# EAGLE design MTR_1_0 (EAGLE 8.3.2)
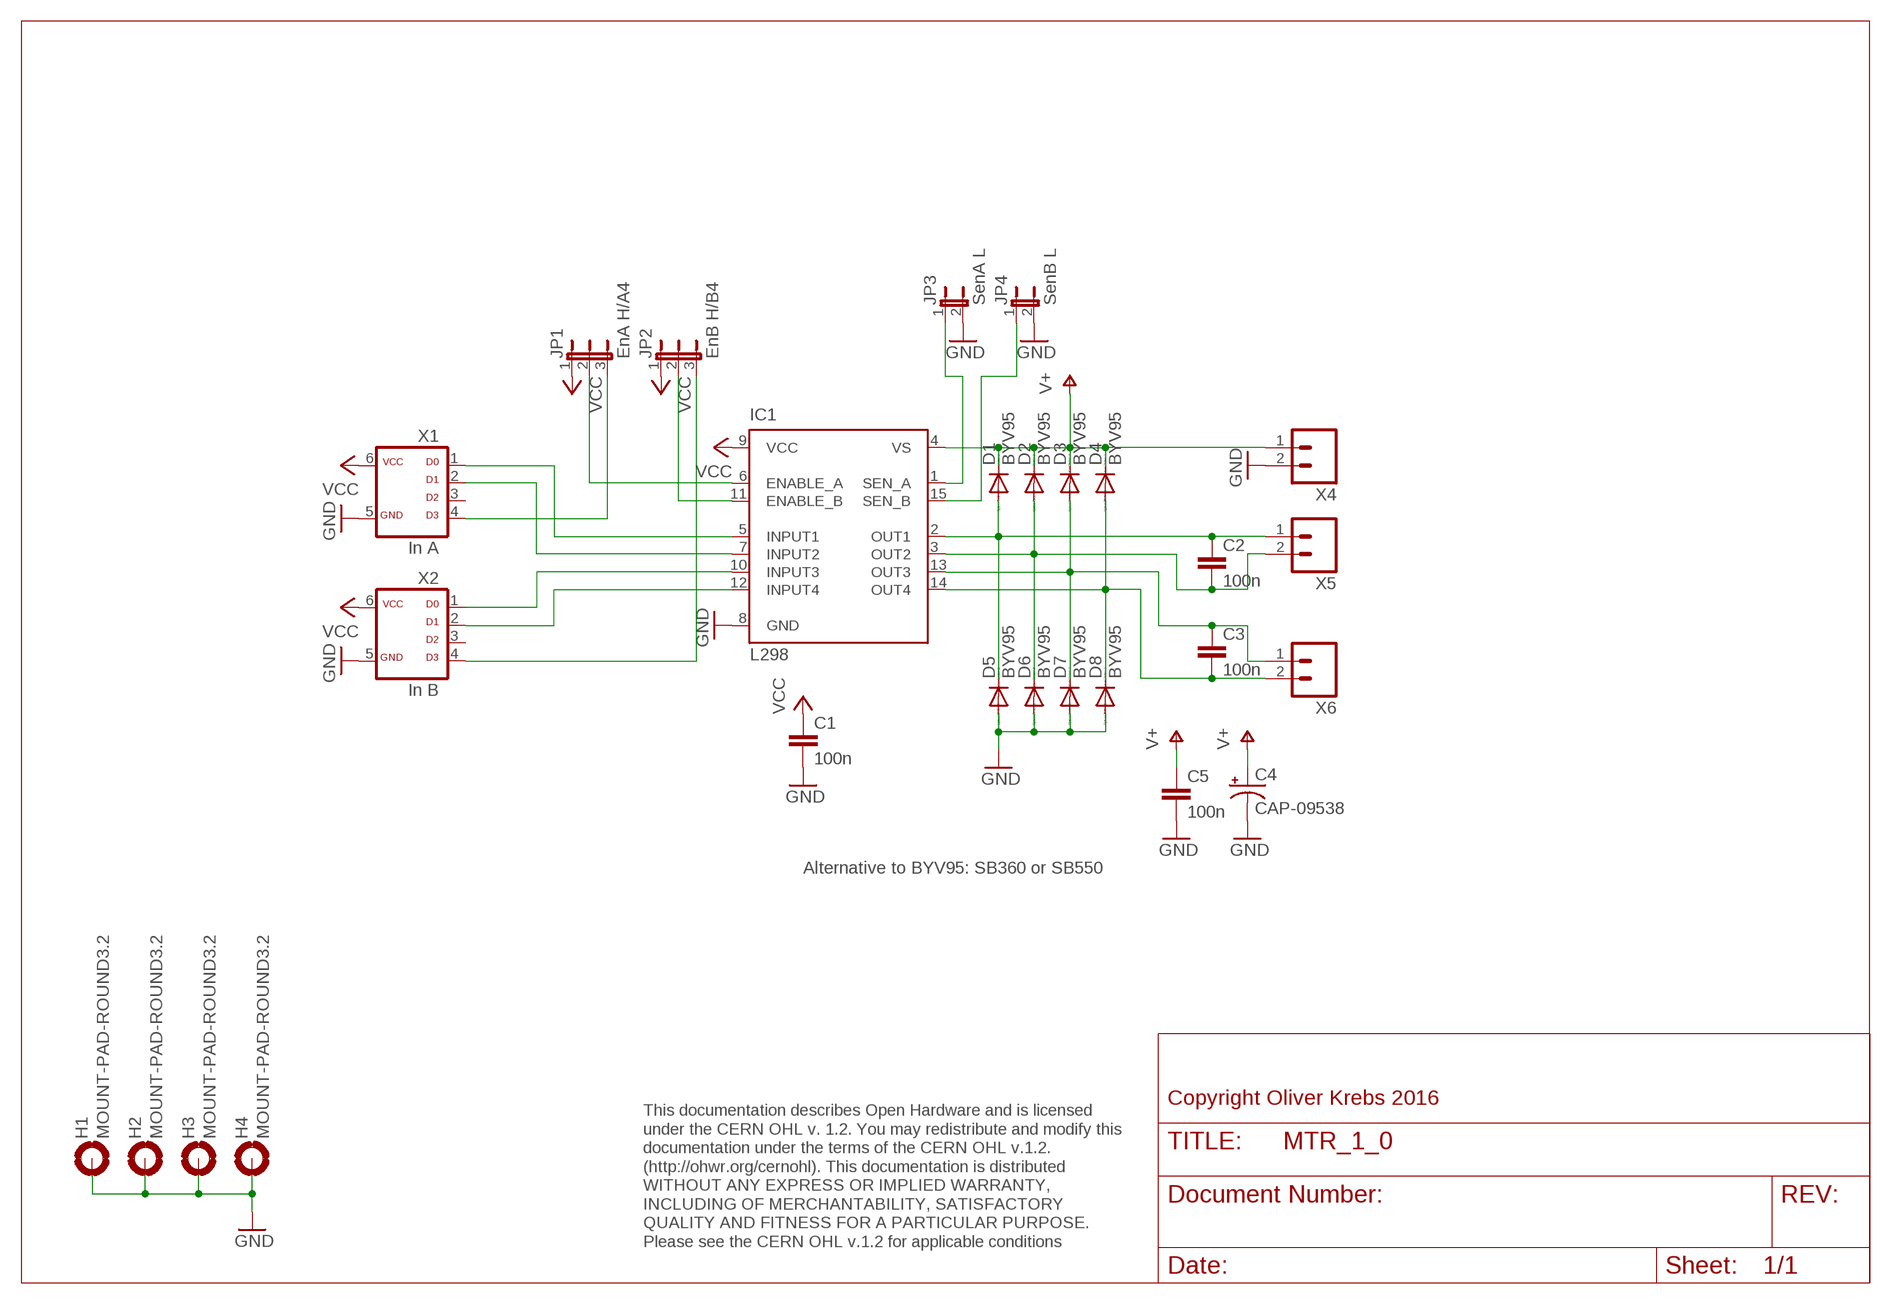
[diagram p0: schematic, sheet 1]

## Parts
C1  100n  C-EU050-025X075  [C050-025X075]
C2  100n  C-EU050-025X075  [C050-025X075]
C3  100n  C-EU050-025X075  [C050-025X075]
C4  CAP-09538  1000UF-25V(PTH)  [CPOL-RADIAL-1000UF-25V]
C5  100n  C-EU050-025X075  [C050-025X075]
D1  BYV95  [SOD57-10]
D2  BYV95  [SOD57-10]
D3  BYV95  [SOD57-10]
D4  BYV95  [SOD57-10]
D5  BYV95  [SOD57-10]
D6  BYV95  [SOD57-10]
D7  BYV95  [SOD57-10]
D8  BYV95  [SOD57-10]
H1  MOUNT-PAD-ROUND3.2  [3,2-PAD]
H2  MOUNT-PAD-ROUND3.2  [3,2-PAD]
H3  MOUNT-PAD-ROUND3.2  [3,2-PAD]
H4  MOUNT-PAD-ROUND3.2  [3,2-PAD]
IC1  L298  [MULTIWATT-15]
JP1  EnA H/A4  JP2EJP2-U  [JP2-U]
JP2  EnB H/B4  JP2EJP2-U  [JP2-U]
JP3  SenA L  JP1E  [JP1]
JP4  SenB L  JP1E  [JP1]
X1  In A  ML6D  [ML-6]
X2  In B  ML6D  [ML-6]
X4  M021.3MM-5.08  [1X02_BIG_5.08]
X5  M021.3MM-5.08  [1X02_BIG_5.08]
X6  M021.3MM-5.08  [1X02_BIG_5.08]

## Nets
GND: C1.2 C4.- C5.2 D5.A D6.A D7.A D8.A H1.B3,2(MOUNT) H2.B3,2(MOUNT) H3.B3,2(MOUNT) H4.B3,2(MOUNT) IC1.8(GND) JP3.2 JP4.2 X1.5 X2.5 X4.2
N$1: JP2.3 X2.4
N$2: IC1.6(ENABLE_A) JP1.2
N$3: IC1.11(ENABLE_B) JP2.2
N$4: JP1.3 X1.4
N$5: C2.1 D1.A D5.C IC1.2(OUT1) X5.1
N$6: C2.2 D2.A D6.C IC1.3(OUT2) X5.2
N$7: C3.1 D3.A D7.C IC1.13(OUT3) X6.1
N$8: C3.2 D4.A D8.C IC1.14(OUT4) X6.2
N$10: IC1.5(INPUT1) X1.1
N$11: IC1.1(SEN_A) JP3.1
N$12: IC1.15(SEN_B) JP4.1
N$13: IC1.7(INPUT2) X1.2
N$14: IC1.10(INPUT3) X2.1
N$15: IC1.12(INPUT4) X2.2
V+: C4.+ C5.1 D1.C D2.C D3.C D4.C IC1.4(VS) X4.1
VCC: C1.1 IC1.9(VCC) JP1.1 JP2.1 X1.6 X2.6
Unconnected: X1.3 X2.3

## Notes on the sheet
- Alternative to BYV95: SB360 or SB550
- Copyright Oliver Krebs 2016
- This documentation describes Open Hardware and is licensed 
  under the CERN OHL v. 1.2. You may redistribute and modify this 
  documentation under the terms of the CERN OHL v.1.2. 
  (http://ohwr.org/cernohl). This documentation is distributed
  WITHOUT ANY EXPRESS OR IMPLIED WARRANTY, 
  INCLUDING OF MERCHANTABILITY, SATISFACTORY 
  QUALITY AND FITNESS FOR A PARTICULAR PURPOSE. 
  Please see the CERN OHL v.1.2 for applicable conditions

## Library data of the parts
C1-C3 C5 = 01-my_rcl:C-EU: CAPACITOR, European symbol
C4 = SparkFun-Capacitors:1000UF-25V(PTH): CAP-08070; PROD_ID: CAP-09538
D1-D8 = diode:BYV95: DIODE fast soft-recovery controlled avalanche rectifier
H1-H4 = holes:MOUNT-PAD-ROUND: MOUNTING PAD, round
IC1 = st-microelectronics:L298: DUAL FULL-BRIDGE DRIVER; MPN: L298N; OC_FARNELL: 1589425; OC_NEWARK: 32M1527
JP1 JP2 = 01-my-jumper:JP2E: JUMPER
JP3 JP4 = 01-my-jumper:JP1E: JUMPER
X1 X2 = 01-my-con:ML6D
X4-X6 = SparkFun-Connectors:M02: Standard 2-pin 0.1" header. Use with - straight break away headers ( PRT-00116) - right angle break away headers (PRT-00553) - swiss pins (PRT-00743) - machine pins (PRT-00117) - female headers (PRT-00115) Molex polarized connector foot print use with: PRT-08233 with associated crimp pins and housings. 2.54_SCREWTERM for use with PRT-10571. 3.5mm Screw Terminal footprints for PRT-08084 5mm Screw Terminal footprints for use with PRT-08432

## Board
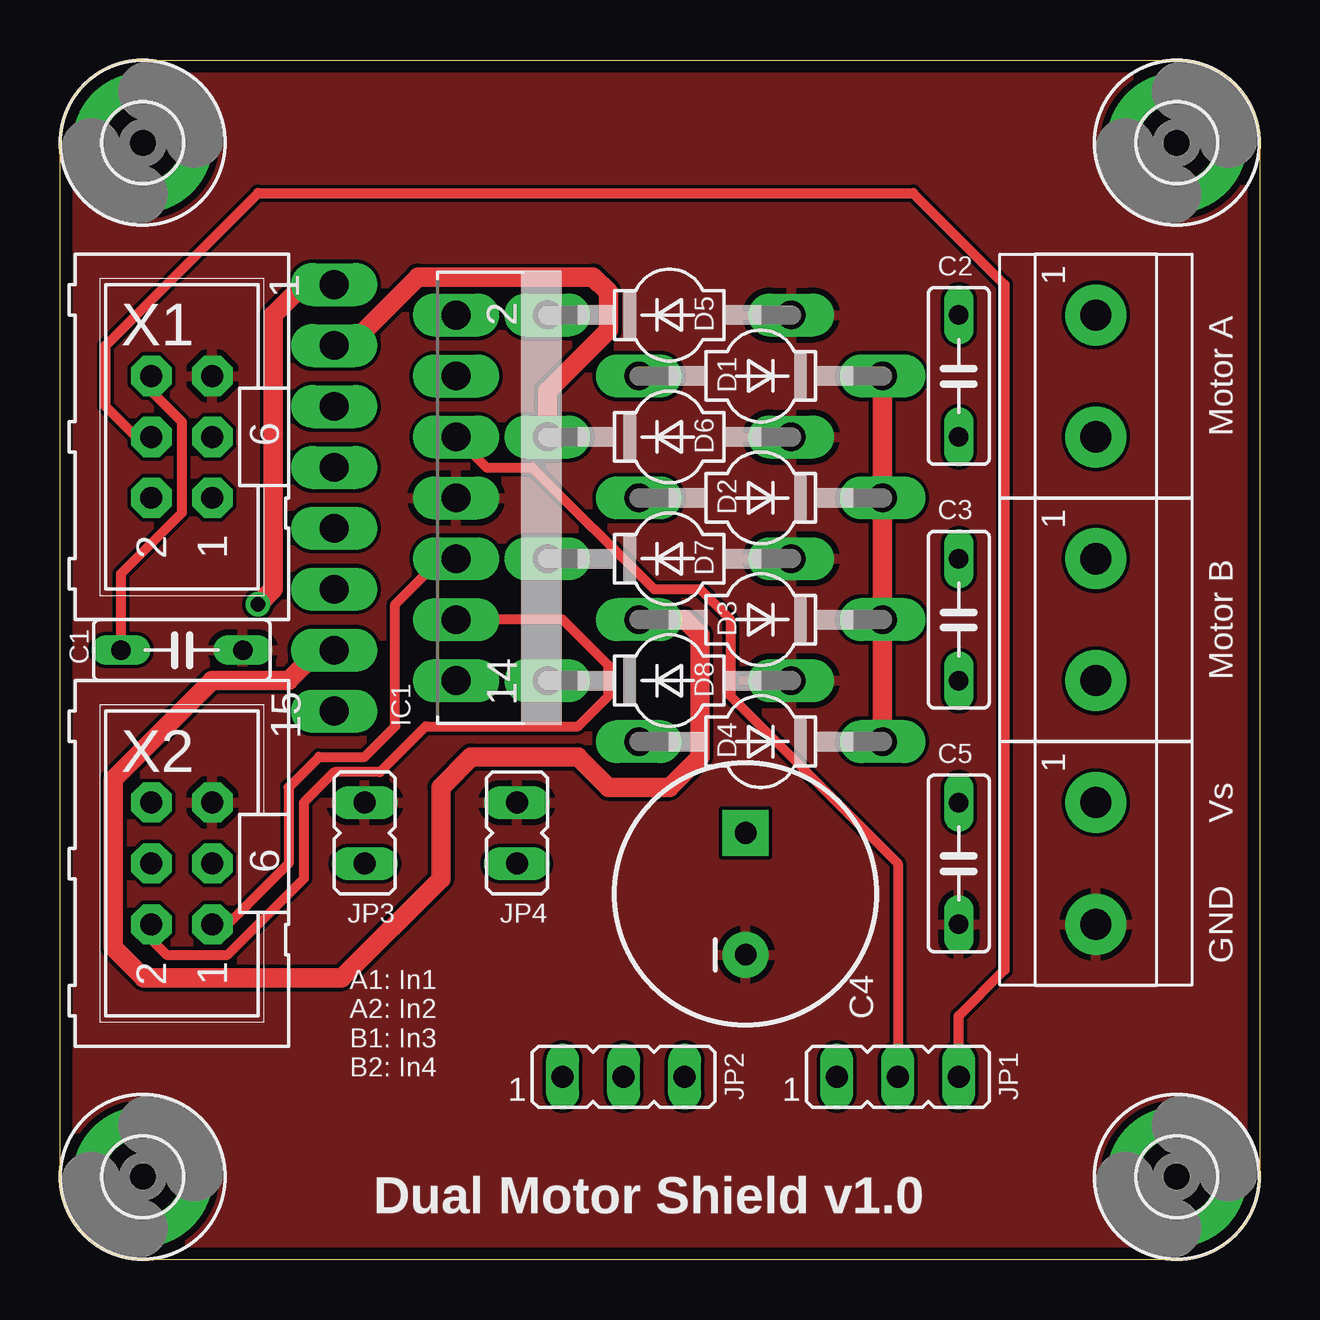
[diagram p1: board, top side]
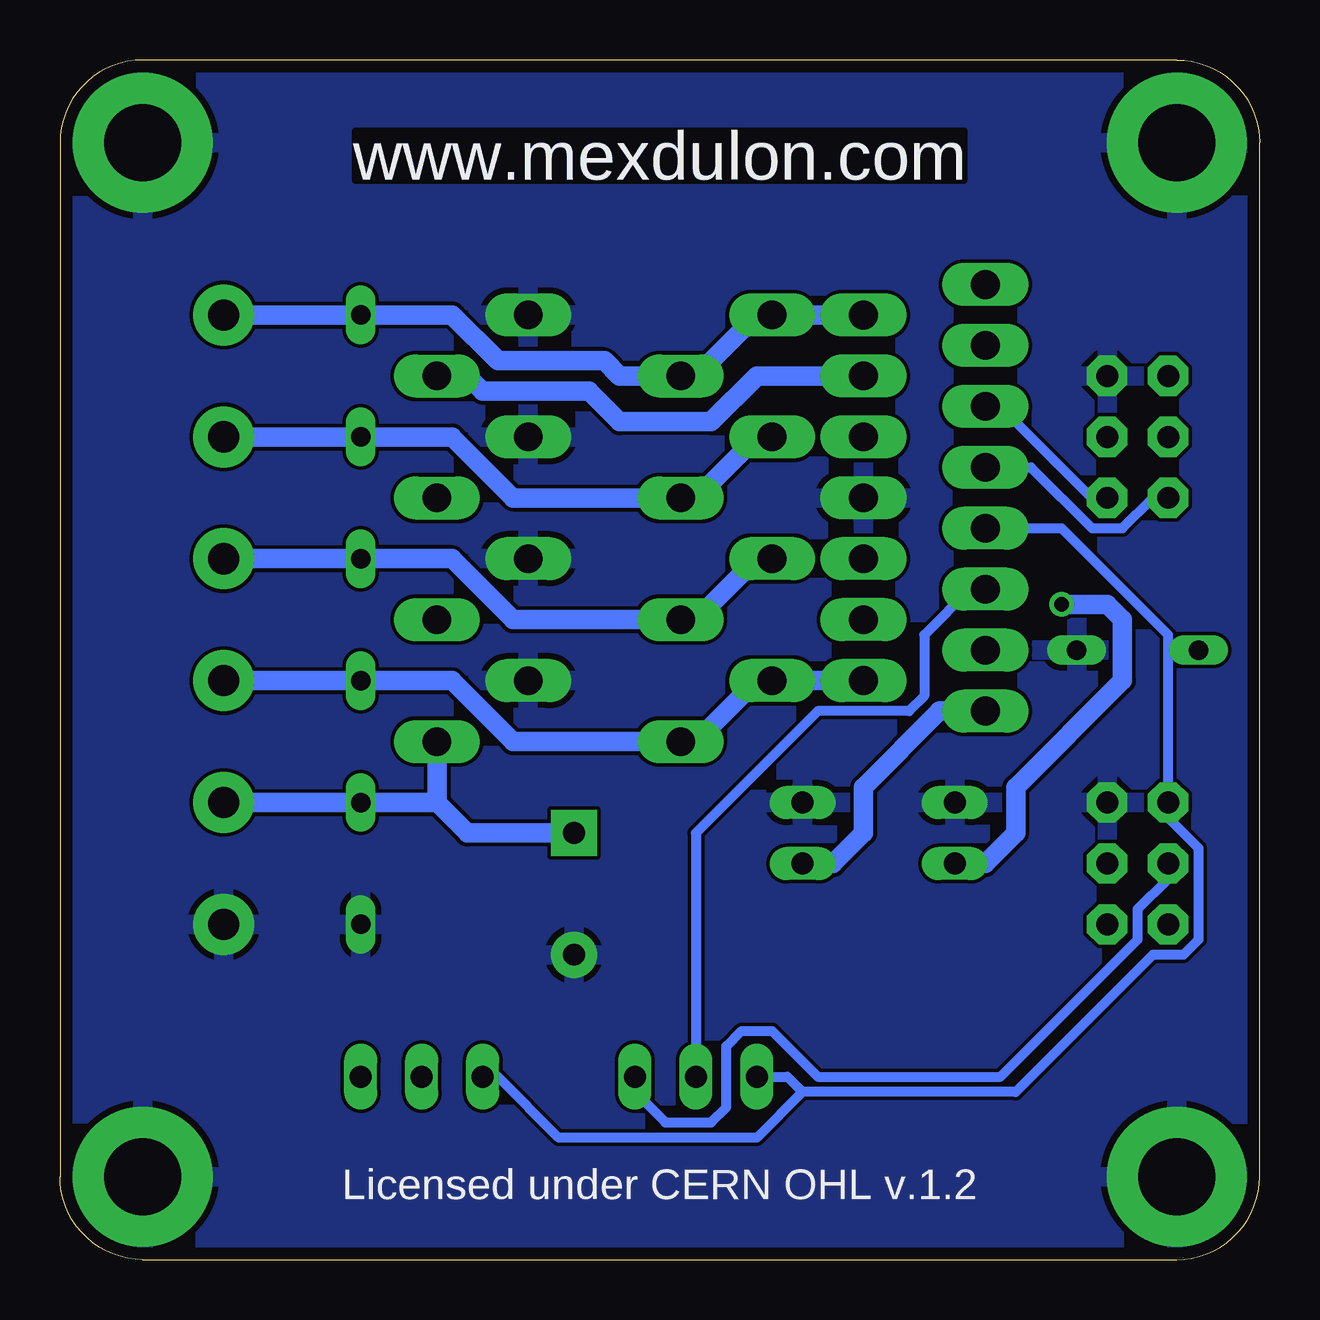
[diagram p2: board, bottom side, seen from below]

Size 50 x 50 mm. Coordinates in mm from the lower left corner, seen from the top.
Outline: 0,3.45 0,46.55 arc-90 3.45,50 46.55,50 arc-90 50,46.55 50,3.45 arc-90 46.55,0 3.45,0 arc-90 0,3.45
Copper layers (1*16): Top 0.035mm / dielectric 1.6mm / Bottom 0.035mm
Design rules "Elecrow_2-layer_PCB_eagle_rule": minimum track width 6mil, minimum drill 12mil, track to track 6mil, track to pad 6mil, pad to pad 6mil, via to via 8mil, smd to smd 0mil, copper to edge 20mil, drill to drill 10mil, minimum pad ring 6mil, minimum via ring 6mil, stop-mask expansion 0mil, vias tented up to drill 100mil, thermal gap 10mil

### Footprints (pad centres in the part's own frame; a part is rotated, then mirrored left to right if it is on the bottom)
C050-025X075 = drill 0.813 long: 1 -2.54,0; 2 2.54,0
CPOL-RADIAL-1000UF-25V = drill 0.9 pad 1.93 square: + 2.54,0 | drill 0.9 pad 1.93: - -2.54,0
SOD57-10 = drill 1.194 long: A 5.08,0; C -5.08,0
3,2-PAD = drill 3.2 pad 5.842: B3,2 0,0
MULTIWATT-15 = drill 1.2 long: 1 -8.89,-7.62; 2 -7.62,-2.54; 3 -6.35,-7.62; 4 -5.08,-2.54; 5 -3.81,-7.62; 6 -2.54,-2.54; 7 -1.27,-7.62; 8 0,-2.54; 9 1.27,-7.62; 10 2.54,-2.54; 11 3.81,-7.62; 12 5.08,-2.54; 13 6.35,-7.62; 14 7.62,-2.54; 15 8.89,-7.62
JP2-U = drill 0.914 long: 1 -2.54,0; 2 0,0; 3 2.54,0
JP1 = drill 0.914 long: 1 0,-1.27; 2 0,1.27
ML-6 = drill 0.914 pad 1.676 octagon: 1 -2.54,-1.27; 2 -2.54,1.27; 3 0,-1.27; 4 0,1.27; 5 2.54,-1.27; 6 2.54,1.27
1X02_BIG_5.08 = drill 1.3 pad 2.54: 1 -2.54,0; 2 2.54,0

### Placement (x,y rotation side)
C1  5.08,25.4 0 top
C2  37.47,36.83 270 top
C3  37.47,26.67 270 top
C4  28.57,15.24 90 top
C5  37.47,16.51 270 top
D1  29.21,36.83 180 top
D2  29.21,31.75 180 top
D3  29.21,26.67 180 top
D4  29.21,21.59 180 top
D5  25.4,39.37 0 top
D6  25.4,34.29 0 top
D7  25.4,29.21 0 top
D8  25.4,24.13 0 top
H1  3.45,3.45 0 top
H2  3.45,46.55 0 top
H3  46.55,3.45 0 top
H4  46.55,46.55 0 top
IC1  19.05,31.75 270 top
JP1  34.92,7.62 0 top
JP2  23.5,7.62 0 top
JP3  12.7,17.78 0 top
JP4  19.05,17.78 0 top
X1  5.08,34.29 90 top
X2  5.08,16.51 90 top
X4  43.18,16.51 270 top
X5  43.18,36.83 270 top
X6  43.18,26.67 270 top

### Tracks (layer width: path | path; a pad name or v marks a point on that pad's centre or on a via)
GND
  pour Bottom: 0,0 50.8,0 50.8,50.8 0,50.8
  pour Top: 0,50.16 50.16,50.16 50.16,0 0,0
N$1
  Bottom 0.406: X2.4 3.81,15.88 5.08,14.61 5.08,13.34 10.79,7.62 18.41,7.62 20.32,9.53 21.59,9.53 22.23,8.89 22.23,6.35 22.86,5.71 24.77,5.71 26.04,6.99 JP2.3
N$2
  Top 0.406: IC1.6 17.78,33.02 19.68,33.02 24.77,27.94 26.67,27.94 27.94,26.67 27.94,23.5 34.92,16.51 JP1.2
N$3
  Bottom 0.406: IC1.11 12.06,27.94 13.97,26.04 13.97,23.5 14.61,22.86 18.41,22.86 23.5,17.78 JP2.2
N$4
  Top 0.406: X1.4 3.17,34.29 1.91,35.56 1.91,38.1 8.26,44.45 35.56,44.45 39.37,40.64 39.37,12.06 37.47,10.16 JP1.3
N$5
  Bottom 0.813: X5.1 C2.1 33.66,39.37 31.75,37.47 27.3,37.47 26.67,36.83 D1.A 23.5,36.83 20.95,39.37 D5.C IC1.2
N$6
  Top 0.813: IC1.3 12.06,38.1 14.92,40.96 22.23,40.96 22.86,40.32 22.86,38.73 20.32,36.2 D6.C
  Bottom 0.813: X5.2 C2.2 33.66,34.29 31.11,31.75 D2.A 23.5,31.75 20.95,34.29 D6.C
N$7
  Top 0.813: IC1.13 10.79,25.4 9.53,24.13 6.35,24.13 2.22,20 2.22,13.02 3.49,11.75 11.75,11.75 15.88,15.88 15.88,19.68 17.14,20.95 21.59,20.95 22.86,19.68 25.4,19.68 26.67,20.95 26.67,26.04 26.04,26.67 D3.A
  Bottom 0.813: X6.1 C3.1 33.66,29.21 31.11,26.67 D3.A 23.5,26.67 20.95,29.21 D7.C
N$8
  Bottom 0.813: X6.2 C3.2 33.66,24.13 31.11,21.59 D4.A 23.5,21.59 20.95,24.13 D8.C IC1.14
N$10
  Bottom 0.406: X1.1 6.99,31.75 10.79,35.56 IC1.5
N$11  (via drill 0.6 pad 1.02)
  Top 0.813: IC1.1 10.16,40.64 8.89,39.37 8.89,27.94 v8.26,27.3
  Bottom 0.813: JP3.1 11.43,16.51 10.16,17.78 10.16,19.68 5.71,24.13 5.71,26.67 6.35,27.3 v8.26,27.3
N$12
  Bottom 0.813: IC1.15 13.34,22.86 16.51,19.68 16.51,17.78 17.78,16.51 JP4.1
N$13
  Bottom 0.406: IC1.7 9.53,33.02 6.99,30.48 5.71,30.48 4.45,31.75 X1.2
N$14
  Top 0.406: X2.1 6.99,13.97 9.53,16.51 9.53,19.68 10.79,20.95 12.7,20.95 13.97,22.23 13.97,27.3 15.88,29.21 IC1.10
N$15
  Top 0.406: IC1.12 20.95,26.67 22.86,24.77 22.86,23.5 21.59,22.23 15.24,22.23 13.34,20.32 11.43,20.32 10.16,19.05 10.16,15.88 6.99,12.7 4.45,12.7 3.81,13.34 X2.2
V+
  Top 0.813: D4.C D3.C D2.C D1.C
  Bottom 0.813: IC1.4 20.95,36.83 22.86,34.92 26.67,34.92 27.94,36.2 32.38,36.2 33.02,36.83 D1.C | C4.+ 33.02,17.78 34.29,19.05 | D4.C 34.29,19.05 | X4.1 C5.1 34.29,19.05
VCC
  Top 0.406: X1.6 3.81,36.2 5.08,34.92 5.08,31.11 2.54,28.57 C1.1
  Bottom 0.406: IC1.9 8.26,30.48 3.81,26.04 3.81,25.4 | 3.81,25.4 X2.6 3.81,18.41 2.54,17.14 2.54,13.34 3.17,12.7 4.45,12.7 10.16,6.99 19.05,6.99 | 19.05,6.99 20.95,5.08 29.21,5.08 31.75,7.62 JP1.1 | JP2.1 19.68,7.62 19.05,6.99 | C1.1 3.81,25.4

### Text on the board
Bottom: www.mexdulon.com
tNames: Motor A | Motor B | Vs | GND | A1: In1 / A2: In2 / B1: In3 / B2: In4 | Dual Motor Shield v1.0
bNames: www.mexdulon.com | Licensed under CERN OHL v.1.2
tValues: Us: 7.5-24V / Imax: 2x 2A